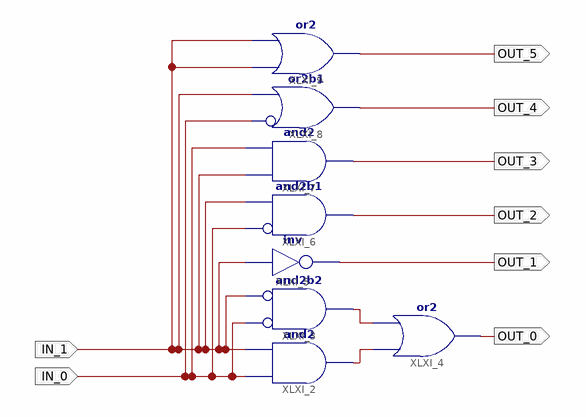
[diagram p0: schematic sheet 1]
// Xilinx ISE schematic Schematic.sch (spartan3a) as structural Verilog: 8 symbols, 8 ports
module Schematic (
  input  IN_0,
  input  IN_1,
  output OUT_0,
  output OUT_1,
  output OUT_2,
  output OUT_3,
  output OUT_4,
  output OUT_5
);

  wire XLXN_1, XLXN_2;

  and XLXI_2 (XLXN_2, IN_0, IN_1);
  and XLXI_3 (XLXN_1, ~IN_0, ~IN_1);  // and2b2
  or XLXI_4 (OUT_0, XLXN_2, XLXN_1);
  not XLXI_5 (OUT_1, IN_1);
  and XLXI_6 (OUT_2, ~IN_0, IN_1);  // and2b1
  and XLXI_7 (OUT_3, IN_1, IN_0);
  or XLXI_8 (OUT_4, ~IN_0, IN_1);  // or2b1
  or XLXI_9 (OUT_5, IN_1, IN_1);
endmodule
